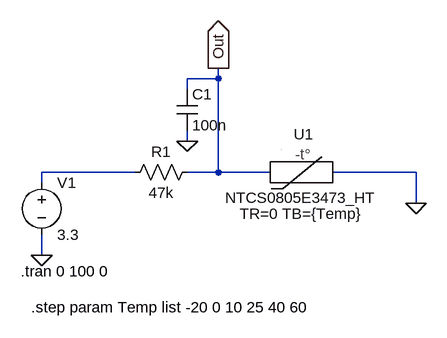
[diagram p0: schematic indoor_temperature.asc]
indoor_temperature.asc, the LTspice schematic file:
Version 4.1
SHEET 1 880 680
WIRE 96 0 96 -16
WIRE 96 0 48 0
WIRE 48 16 48 0
WIRE 48 96 48 80
WIRE -32 144 -176 144
WIRE 96 144 96 0
WIRE 96 144 48 144
WIRE 176 144 96 144
WIRE 400 144 272 144
WIRE -176 160 -176 144
WIRE 400 192 400 144
WIRE -176 272 -176 240
FLAG 400 192 0
FLAG -176 272 0
FLAG 96 -16 Out
IOPIN 96 -16 Out
FLAG 48 96 0
SYMBOL NTCS0805E3473_HT 224 144 R0
SYMATTR InstName U1
SYMATTR SpiceLine TR=0 TB={Temp}
SYMBOL res 64 128 R90
WINDOW 0 0 56 VBottom 2
WINDOW 3 32 56 VTop 2
SYMATTR InstName R1
SYMATTR Value 47k
SYMBOL voltage -176 144 R0
WINDOW 123 0 0 Left 0
WINDOW 39 0 0 Left 0
SYMATTR InstName V1
SYMATTR Value 3.3
SYMBOL cap 32 16 R0
SYMATTR InstName C1
SYMATTR Value 100n
TEXT -208 296 Left 2 !.tran 0 100 0
TEXT -192 352 Left 2 !.step param Temp list -20 0 10 25 40 60

The netlist it stands for:
* indoor_temperature.asc
X§U1 Out 0 NTCS0805E3473_HT TR=0 TB={Temp}  ; pins RN Rp
R1 Out N001 47k
V1 N001 0 3.3
C1 Out 0 100n
.tran 0 100 0
.step param Temp list -20 0 10 25 40 60
.lib VISHAY_LTSPICE_Therm_MC.lib
.backanno
.end